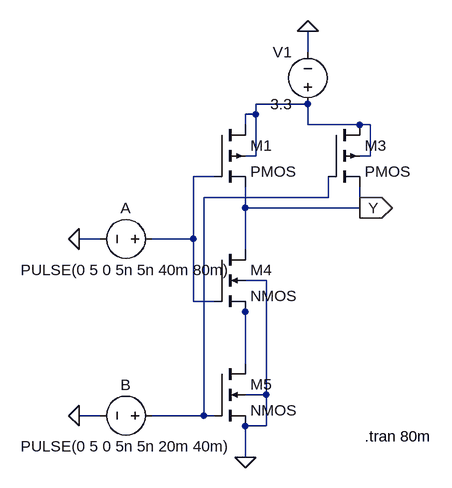
[diagram p0: schematic NAND.asc]
NAND.asc, the LTspice schematic file:
Version 4
SHEET 1 880 680
WIRE 128 -32 128 -64
WIRE 128 48 48 48
WIRE 48 64 48 48
WIRE 48 64 32 64
WIRE 32 80 32 64
WIRE 128 80 128 48
WIRE 208 80 128 80
WIRE 224 80 208 80
WIRE 48 128 48 64
WIRE 48 128 32 128
WIRE 224 128 224 80
WIRE 224 128 208 128
WIRE -16 160 -48 160
WIRE 160 192 160 160
WIRE 160 192 -32 192
WIRE 32 208 32 176
WIRE 208 208 208 176
WIRE 208 208 32 208
WIRE -192 256 -224 256
WIRE -48 256 -48 160
WIRE -48 256 -112 256
WIRE 32 272 32 208
WIRE 64 320 32 320
WIRE -48 352 -48 256
WIRE -16 352 -48 352
WIRE 32 368 32 352
WIRE 32 448 32 368
WIRE 64 496 64 320
WIRE 64 496 32 496
WIRE -192 528 -224 528
WIRE -32 528 -32 192
WIRE -32 528 -112 528
WIRE -16 528 -32 528
WIRE 64 544 64 496
WIRE 64 544 32 544
WIRE 32 592 32 544
FLAG 32 592 0
FLAG 128 -64 0
FLAG -224 256 0
FLAG -224 528 0
FLAG 208 208 Y
IOPIN 208 208 Out
SYMBOL pmos4 -16 80 R0
SYMATTR InstName M1
SYMATTR Value2 l=1040nm w=1040nm
SYMBOL nmos4 -16 272 R0
SYMATTR InstName M4
SYMATTR Value2 l=1040nm w=1040nm
SYMBOL nmos4 -16 448 R0
SYMATTR InstName M5
SYMATTR Value2 l=1040nm w=1040nm
SYMBOL voltage 128 64 R180
WINDOW 0 24 96 Left 2
WINDOW 3 24 16 Left 2
WINDOW 123 0 0 Left 0
WINDOW 39 0 0 Left 0
SYMATTR InstName V1
SYMATTR Value 3.3
SYMBOL voltage -96 256 R90
WINDOW 0 -32 56 VBottom 2
WINDOW 3 32 56 VTop 2
WINDOW 123 0 0 Left 0
WINDOW 39 0 0 Left 0
SYMATTR InstName A
SYMATTR Value PULSE(0 5 0 5n 5n 40m 80m)
SYMBOL voltage -96 528 R90
WINDOW 0 -32 56 VBottom 2
WINDOW 3 32 56 VTop 2
WINDOW 123 0 0 Left 0
WINDOW 39 0 0 Left 0
SYMATTR InstName B
SYMATTR Value PULSE(0 5 0 5n 5n 20m 40m)
SYMBOL pmos4 160 80 R0
SYMATTR InstName M3
TEXT 216 560 Left 2 !.tran 80m

The netlist it stands for:
* NAND.asc
M1 N001 N002 Y N001 PMOS l=1040nm w=1040nm
M4 Y N002 N004 0 NMOS l=1040nm w=1040nm
M5 N004 N003 0 0 NMOS l=1040nm w=1040nm
V1 N001 0 3.3
V§A N002 0 PULSE(0 5 0 5n 5n 40m 80m)
V§B N003 0 PULSE(0 5 0 5n 5n 20m 40m)
M3 N001 N003 Y N001 PMOS
.model NMOS NMOS
.model PMOS PMOS
.lib standard.mos
.tran 80m
.backanno
.end